# Altium schematic sheet top.SchDoc
size A4
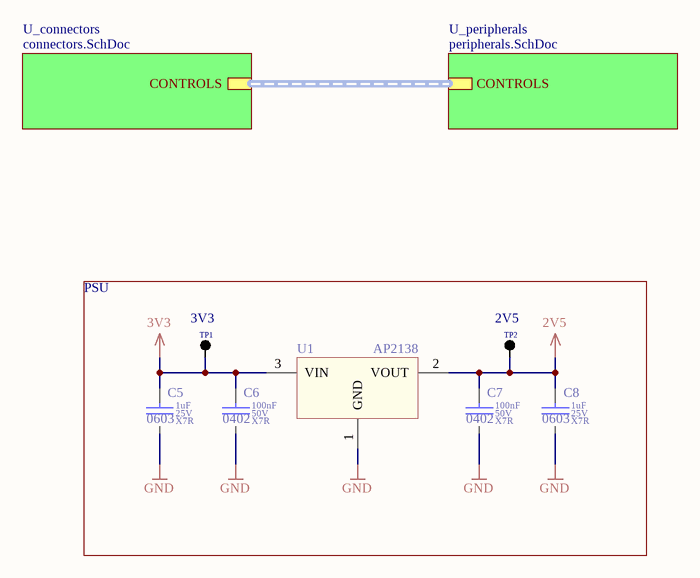
[diagram p0: top.SchDoc]

## Parts
C5  value 1uF  Dielectric: X7R  Voltage: 25V  SCH_Footprint: 0603  [C_0603_1608]  (hidden comment: Ceramic X7R)
C6  value 100nF  Dielectric: X7R  Voltage: 50V  SCH_Footprint: 0402  [C_0402_1005]  (hidden comment: Ceramic X7R)
C7  value 100nF  Dielectric: X7R  Voltage: 50V  SCH_Footprint: 0402  [C_0402_1005]  (hidden comment: Ceramic X7R)
C8  value 1uF  Dielectric: X7R  Voltage: 25V  SCH_Footprint: 0603  [C_0603_1608]  (hidden comment: Ceramic X7R)
TP1  3V3  [TP_PAD]
TP2  2V5  [TP_PAD]
U1  AP2138  [AP2138]

## Blocks framed on the sheet
PSU: C5-C8 TP1 TP2 U1

## Sub-sheets
U_connectors = connectors.SchDoc: CONTROLS (harness CONTROLS)
U_peripherals = peripherals.SchDoc: CONTROLS (harness CONTROLS)

## Nets
2V5: C7.1 C8.1 TP2.1(TP) U1.2(VOUT)
3V3: C5.1 C6.1 TP1.1(TP) U1.3(VIN)
GND: C5.2 C6.2 C7.2 C8.2 U1.1(GND)

## Buses and harness runs
harness sheet U_connectors/CONTROLS = sheet U_peripherals/CONTROLS

## Library data of the parts
C5 C8 = C_1uF_25V_X7R_0603_10: Capacitor; Manufacturer: Samsung; Manufacturer Part Number: CL10B105KA8NNNC; Tolerance (%): 10; Part Number: C_1uF_25V_X7R_0603_10; HelpURL: http://www.tme.eu/pl/Document/4a42202b32dab16128fe107dd69598cc/samsung-chip-cap.pdf; Supplier 1: TME; Supplier Part Number 1: CL10B105KA8NNNC; Supplier 2: RS Components; Supplier 3: Farnell; Supplier 4: Mouser; Supplier 5: Digi-Key
C6 C7 = C_100nF_50V_X7R_0402_10: Capacitor; Manufacturer: Murata; Manufacturer Part Number: GRM155R71H104KE14D; Tolerance (%): 10; Part Number: C_100nF_50V_X7R_0402_10; HelpURL: http://docs-europe.electrocomponents.com/webdocs/145f/0900766b8145f9d2.pdf; Supplier 1: TME; Supplier Part Number 1: GRM155R71H104KE14D; Supplier 2: RS Components; Supplier Part Number 2: 8847087; Supplier 3: Farnell; Supplier Part Number 3: 2611912; Supplier 4: Mouser; Supplier Part Number 4: 81-GRM155R71H104KE4D; Supplier 5: Digi-Key; Supplier Part Number 5: 490-10700-1-ND
TP1 TP2 = TP_PAD: Testpoint; SCH_Footprint: SMD; Part Number: TP_PAD; Component Type: Standard (No BOM); Supplier 1: TME; Supplier 2: RS Components; Supplier 3: Farnell; Supplier 4: Mouser; Supplier 5: Digi-Key
U1 = AP2138: IC: stabilizator napięcia; LDO,liniowy,nieregulowany; 2,5V; SMD